# EAGLE schematic cytron-1 (EAGLE 9.6.2)
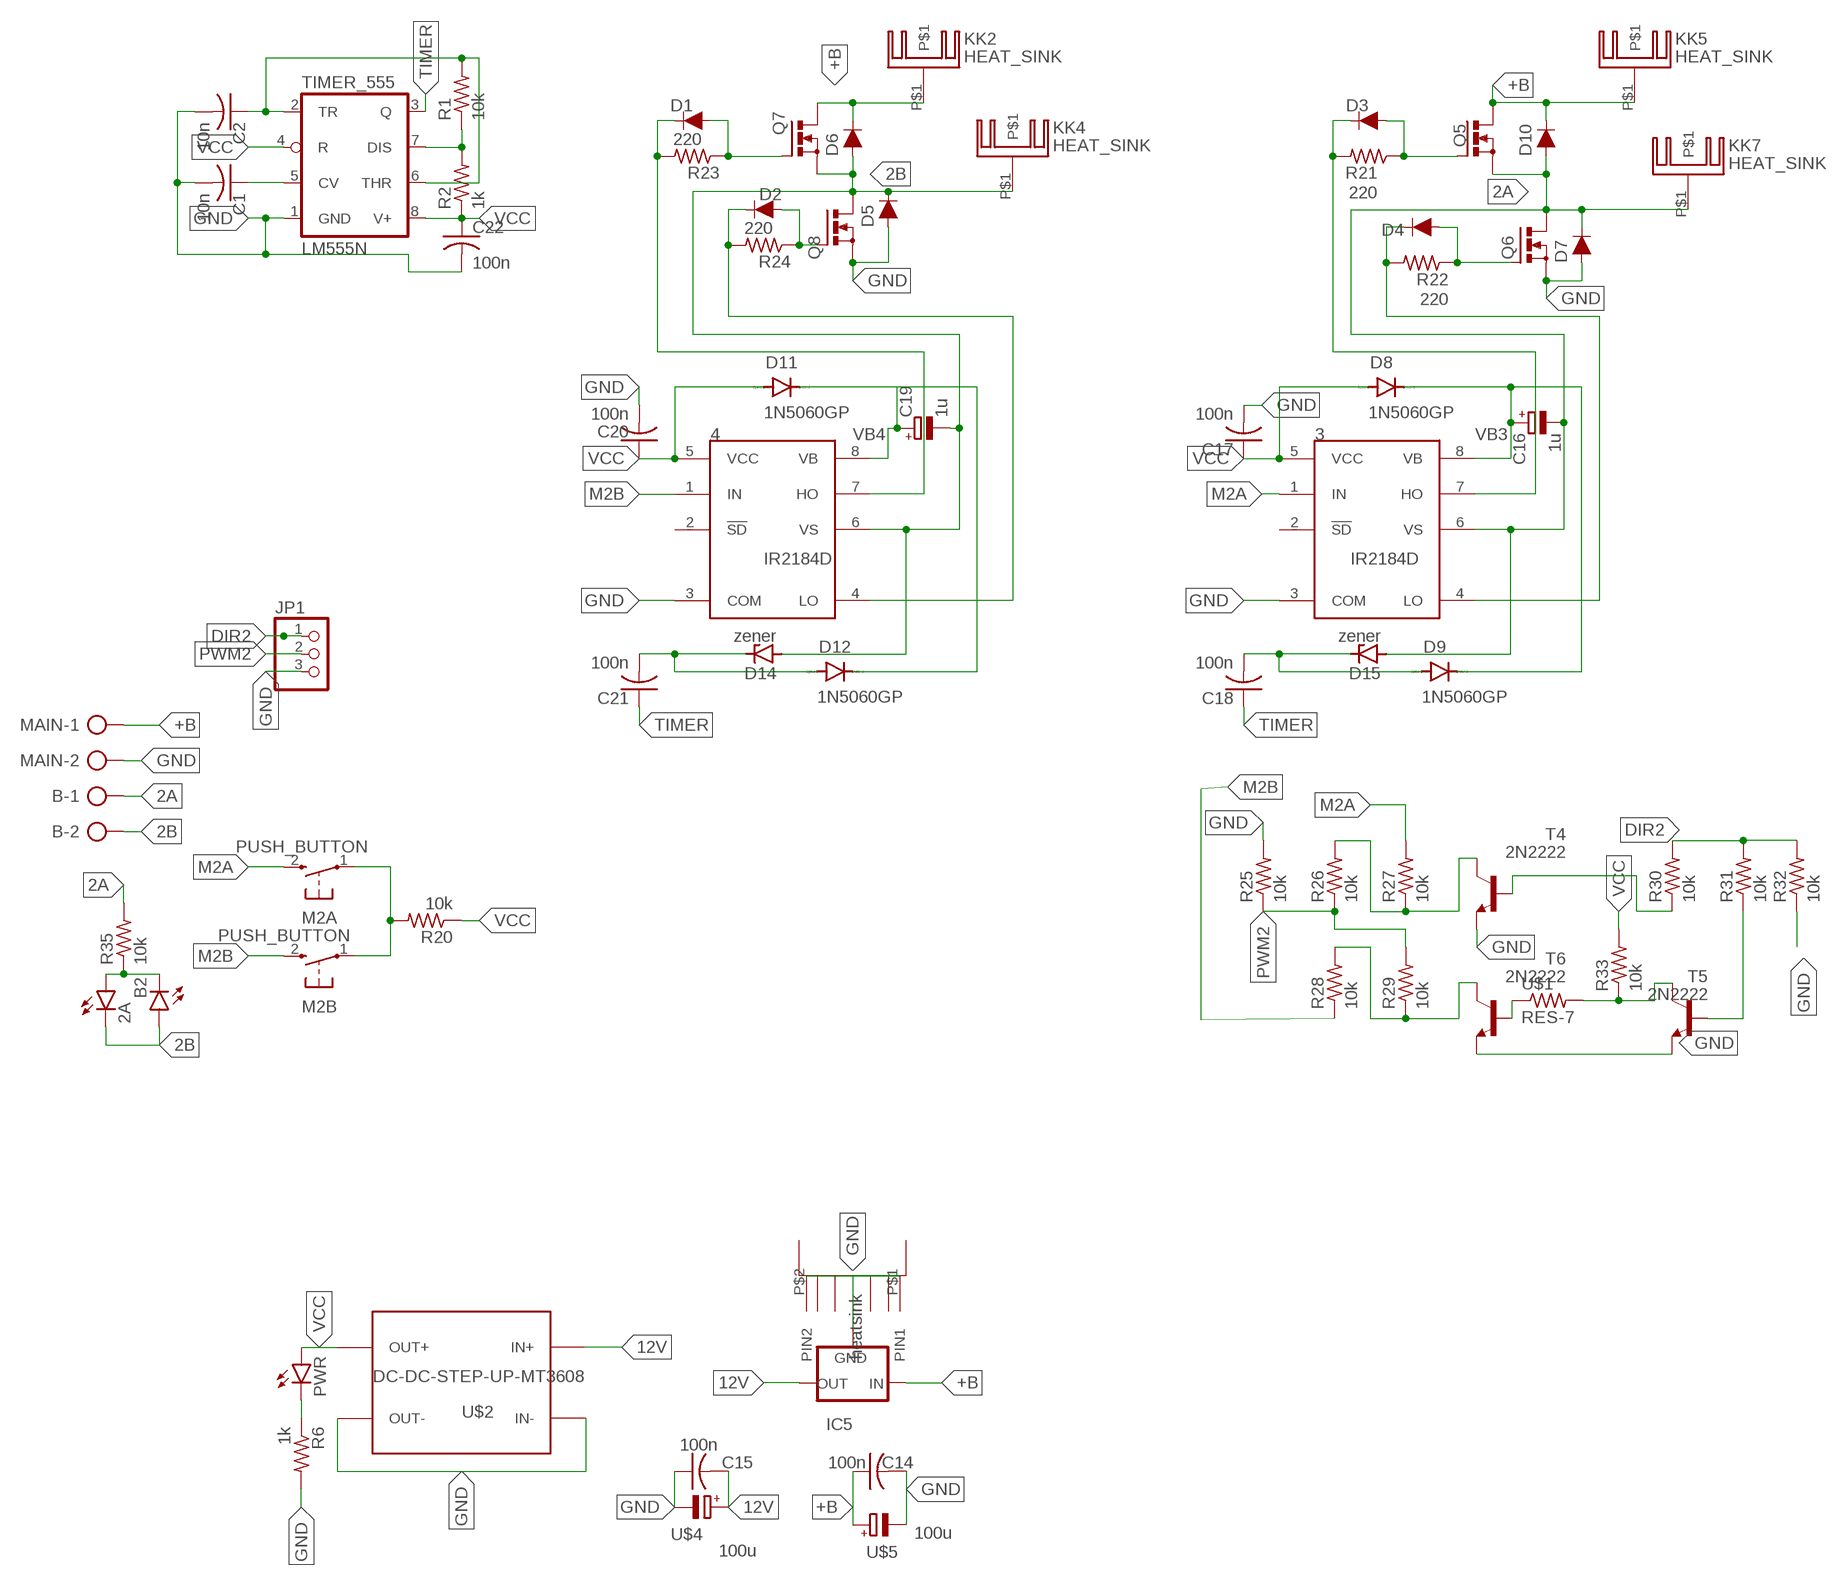
[diagram p0: schematic, sheet 1]

## Parts
2A  LED3MM  [LED3MM]
3  IR2184D  [DIL08]
4  IR2184D  [DIL08]
B  ROSTA.POWER  [W239-302]
B2  LED3MM  [LED3MM]
C1  10n  C-US025-025X050  [C025-025X050]
C2  10n  C-US025-025X050  [C025-025X050]
C14  100n  C-US025-025X050  [C025-025X050]
C15  100n  C-US025-025X050  [C025-025X050]
C16  1u  CPOL-EUE5-5  [E5-5]
C17  100n  C-US025-025X050  [C025-025X050]
C18  100n  C-US025-025X050  [C025-025X050]
C19  1u  CPOL-EUE5-5  [E5-5]
C20  100n  C-US025-025X050  [C025-025X050]
C21  100n  C-US025-025X050  [C025-025X050]
C22  100n  C-US025-025X050  [C025-025X050]
D1  1A/50V/1.1V  DIODE(1A)-PTH  [DIODE-1N4001]
D2  1A/50V/1.1V  DIODE(1A)-PTH  [DIODE-1N4001]
D3  1A/50V/1.1V  DIODE(1A)-PTH  [DIODE-1N4001]
D4  1A/50V/1.1V  DIODE(1A)-PTH  [DIODE-1N4001]
D5  1A/50V/1.1V  DIODE(1A)-PTH  [DIODE-1N4001]
D6  1A/50V/1.1V  DIODE(1A)-PTH  [DIODE-1N4001]
D7  1A/50V/1.1V  DIODE(1A)-PTH  [DIODE-1N4001]
D8  1N5060GP  [DO15-12]
D9  1N5060GP  [DO15-12]
D10  1A/50V/1.1V  DIODE(1A)-PTH  [DIODE-1N4001]
D11  1N5060GP  [DO15-12]
D12  1N5060GP  [DO15-12]
D14  zener  BZD23  [SOD81]
D15  zener  BZD23  [SOD81]
IC5  78XXL  [78XXL]
JP1  PINHD-3_DATA  [1X03_DATA]
KK2  HEAT_SINK  [SK95-2M3]
KK4  HEAT_SINK  [SK95-2M3]
KK5  HEAT_SINK  [SK95-2M3]
KK7  HEAT_SINK  [SK95-2M3]
M2A  PUSH_BUTTON  [B3F-10XX]
M2B  PUSH_BUTTON  [B3F-10XX]
MAIN  ROSTA.POWER  [W239-302]
PWR  LED5MM  [LED5MM]
Q5  MOSFET_NTO220BV  [TO220BV]
Q6  MOSFET_NTO220BV  [TO220BV]
Q7  MOSFET_NTO220BV  [TO220BV]
Q8  MOSFET_NTO220BV  [TO220BV]
R1  10k  R-US_0204/7  [0204/7]
R2  1k  R-US_0204/7  [0204/7]
R6  1k  R-US_0204/7  [0204/7]
R20  10k  R-US_0204/7  [0204/7]
R21  220  R-US_0204/7  [0204/7]
R22  220  R-US_0204/7  [0204/7]
R23  220  R-US_0204/7  [0204/7]
R24  220  R-US_0204/7  [0204/7]
R25  10k  R-US_0204/7  [0204/7]
R26  10k  R-US_0204/7  [0204/7]
R27  10k  R-US_0204/7  [0204/7]
R28  10k  R-US_0204/7  [0204/7]
R29  10k  R-US_0204/7  [0204/7]
R30  10k  R-US_0204/7  [0204/7]
R31  10k  R-US_0204/7  [0204/7]
R32  10k  R-US_0204/7  [0204/7]
R33  10k  R-US_0204/7  [0204/7]
R35  10k  R-US_0204/7  [0204/7]
T4  2N2222  [TO18]
T5  2N2222  [TO18]
T6  2N2222  [TO18]
TIMER_555  LM555N  [DIL08]
U$1  RES-7  [0204/7]
U$2  DC-DC-STEP-UP-MT3608  [DC-DC-STEP-UP-MT3608]
U$3  HEAT-SINK  [HEAT_SINK]
U$4  100u  CAP_POL  [E3,5-8]
U$5  100u  CAP_POL  [E3,5-8]

## Nets
2A: 3.6(VS) B.1 C16.- D7.C D10.A D15.A KK7.P$1 Q5.S Q6.D R35.2
2B: 2A.K(C) 4.6(VS) B2.A B.2 C19.- D5.C D6.A D14.A KK4.P$1 Q7.S Q8.D
12V: C15.2 IC5.OUT U$2.IN+ U$4.+
+B: C14.1 D6.C D10.C IC5.IN KK2.P$1 KK5.P$1 MAIN.1 Q5.D Q7.D U$5.+
DIR2: JP1.1 R30.2 R31.2 R32.2
GND: 3.3(COM) 4.3(COM) C1.2 C2.2 C14.2 C15.1 C17.2 C20.2 C22.2 D5.A D7.A IC5.GND JP1.3 MAIN.2 Q6.S Q8.S R6.2 R25.2 R32.1 T4.1(E) T5.1(E) T6.1(E) TIMER_555.1(GND) U$2.IN- U$2.OUT- U$3.P$1(PIN1) U$3.P$2(PIN2) U$4.- U$5.-
M2A: 3.1(IN) M2A.2(S) R27.2
M2B: 4.1(IN) M2B.2(S) R28.1
N$1: PWR.K(C) R6.1
N$2: C1.1 TIMER_555.5(CV)
N$3: R1.1 R2.2 TIMER_555.7(DIS)
N$4: C2.1 R1.2 TIMER_555.2(TR) TIMER_555.6(THR)
N$5: D4.A Q6.G R22.1
N$6: 3.4(LO) D4.C R22.2
N$7: M2A.1(P) M2B.1(P) R20.2
N$8: T6.2(B) U$1.1
N$11: 4.7(HO) D1.C R23.2
N$13: 4.4(LO) D2.C R24.2
N$25: D3.A Q5.G R21.1
N$30: 3.7(HO) D3.C R21.2
N$31: C18.2 D9.A D15.C
N$32: D2.A Q8.G R24.1
N$33: D1.A Q7.G R23.1
N$36: C21.2 D12.A D14.C
N$37: R28.2 R29.1 T6.3(C)
N$38: R26.2 R27.1 T4.3(C)
N$39: R30.1 T4.2(B)
N$40: R33.1 T5.3(C) U$1.2
N$41: R31.1 T5.2(B)
N$46: 2A.A B2.K(C) R35.1
PWM2: JP1.2 R25.1 R26.1 R29.2
TIMER: C18.1 C21.1 TIMER_555.3(Q)
VB3: 3.8(VB) C16.+ D8.C D9.C
VB4: 4.8(VB) C19.+ D11.C D12.C
VCC: 3.5(VCC) 4.5(VCC) C17.1 C20.1 C22.1 D8.A D11.A PWR.A R2.1 R20.1 R33.2 TIMER_555.4(R) TIMER_555.8(V+) U$2.OUT+
Unconnected: 3.2(!SD) 4.2(!SD)

## Library data of the parts
2A B2 PWR = led:LED: LED OSRAM: - CHIPLED LG R971, LG N971, LY N971, LG Q971, LY Q971, LO R971, LY R971 LH N974, LH R974 LS Q976, LO Q976, LY Q976 LO Q996 - Hyper CHIPLED LW Q18S LB Q993, LB Q99A, LB R99A - SideLED LS A670, LO A670, LY A670, LG A670, LP A670 LB A673, LV A673, LT A673, LW A673 LH A674 LY A675 LS A676, LA A676, LO A676, LY A676, LW A676 LS A679, LY A679, LG A679 - Hyper Micro SIDELED® LS Y876, LA Y876, LO Y876, LY Y876 LT Y87S - SmartLED LW L88C, LW L88S LB L89C, LB L89S, LG L890 LS L89K, LO L89K, LY L89K LS L896, LA L896, LO L896, LY L896 - TOPLED LS T670, LO T670, LY T670, LG T670, LP T670 LSG T670, LSP T670, LSY T670, LOP T670, LYG T670 LG T671, LOG T671, LSG T671 LB T673, LV T673, LT T673, LW T673 LH T674 LS T676, LA T676, LO T676, LY T676, LB T676, LH T676, LSB T676, LW T676 LB T67C, LV T67C, LT T67C, LS T67K, LO T67K, LY T67K, LW E67C LS E67B, LA E67B, LO E67B, LY E67B, LB E67C, LV E67C, LT E67C LW T67C LS T679, LY T679, LG T679 LS T770, LO T770, LY T770, LG T770, LP T770 LB T773, LV T773, LT T773, LW T773 LH T774 LS E675, LA E675, LY E675, LS T675 LS T776, LA T776, LO T776, LY T776, LB T776 LHGB T686 LT T68C, LB T68C - Hyper Mini TOPLED® LB M676 - Mini TOPLED Santana® LG M470 LS M47K, LO M47K, LY M47K Source: http://www.osram.convergy.de LUXEON: - LUMILED® LXK2-PW12-R00, LXK2-PW12-S00, LXK2-PW14-U00, LXK2-PW14-V00 LXK2-PM12-R00, LXK2-PM12-S00, LXK2-PM14-U00 LXK2-PE12-Q00, LXK2-PE12-R00, LXK2-PE12-S00, LXK2-PE14-T00, LXK2-PE14-U00 LXK2-PB12-K00, LXK2-PB12-L00, LXK2-PB12-M00, LXK2-PB14-N00, LXK2-PB14-P00, LXK2-PB14-Q00 LXK2-PR12-L00, LXK2-PR12-M00, LXK2-PR14-Q00, LXK2-PR14-R00 LXK2-PD12-Q00, LXK2-PD12-R00, LXK2-PD12-S00 LXK2-PH12-R00, LXK2-PH12-S00 LXK2-PL12-P00, LXK2-PL12-Q00, LXK2-PL12-R00 Source: www.luxeon.com KINGBRIGHT: KA-3528ASYC Source: www.kingbright.com
3 4 = irs:IR2184
B MAIN = MIA_LIBRARY-2-2-2:ROSTA.POWER: WAGO SCREW CLAMP; OC_FARNELL: unknown; OC_NEWARK: unknown
C1 C2 C14 C15 C17 C18 C20-C22 = rcl8:C-US: CAPACITOR, American symbol; SPICEPREFIX: C
C16 C19 = rcl8:CPOL-EU: POLARIZED CAPACITOR, European symbol; SPICEPREFIX: C
D1-D7 D10 = MIA_LIBRARY-2-2-2:DIODE(1A): Diode These are standard reverse protection diodes and small signal diodes. SparkFun Products: SparkFun SparkPunk Sound Kit <https://www.sparkfun.com/products/11177> SparkFun ESP8266 Thing <https://www.sparkfun.com/products/13231>; PROD_ID: DIO-09176
D8 D9 D11 D12 = diode:1N5060GP: DIODE controlled avalanche rectifier
D14 D15 = diode:BZD23: Z DIODE
IC5 = MIA_LIBRARY-2-2-2:78XXL: VOLTAGE REGULATOR
JP1 = MIA_LIBRARY-2-2-2:PINHD-3_DATA: PIN HEADER
KK2 KK4 KK5 KK7 = MIA_LIBRARY-2-2-2:HEAT_SINK: HEATSINK manufacturer Fischer/distributor Buerklin
M2A M2B = MIA_LIBRARY (1):PUSH_BUTTON: OMRON SWITCH
Q5-Q8 = MIA_LIBRARY-2-2-2:MOSFET_N: Power MOSFET N-Channel
R1 R2 R6 R20-R33 R35 = rcl8:R-US_: RESISTOR, American symbol; SPICEPREFIX: R
T4-T6 = transistor:2N2222: NPN TRANSISTOR; SPICEPREFIX: J
TIMER_555 = linear:*555: TIMER
U$1 = MIA_LIBRARY-2-2-2:RES-7; SPICEPREFIX: B
U$2 = MIA_LIBRARY-2-2-2:DC-DC-STEP-UP-MT3608: DC/DC Step-Up Regulator based on MT3608 chip MT3608 datasheet available here: https://www.olimex.com/Products/Breadboarding/BB-PWR-3608/resources/MT3608.pdf Click here to find device on ebay.com <http://www.ebay.com/sch/mt3608+module>
U$3 = MIA_LIBRARY-2-2-2:HEAT-SINK
U$4 U$5 = MIA_LIBRARY-2-2-2:CAP_POL